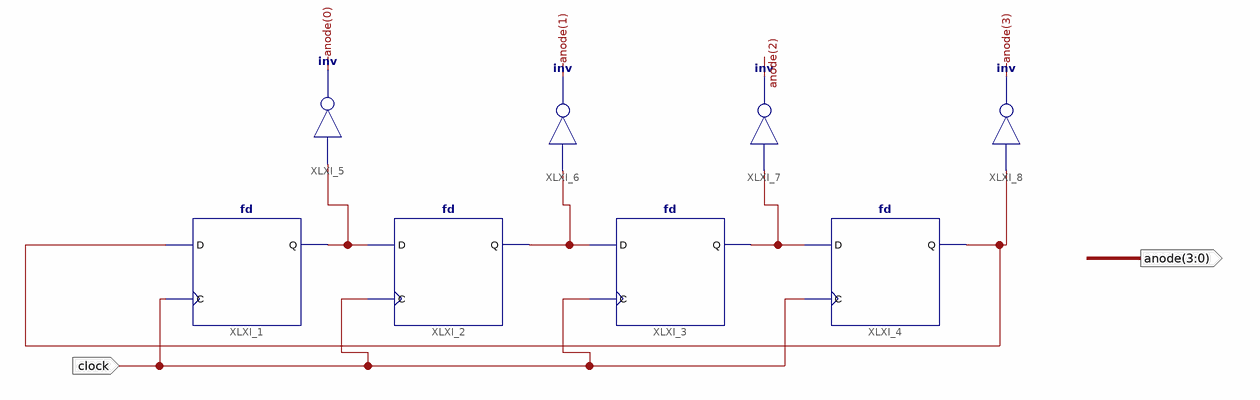
[diagram p0: schematic sheet 1]
// Xilinx ISE schematic ringcounter.sch (artix7) as structural Verilog: 8 symbols, 2 ports
module ringcounter (
  input  clock,
  output [3:0] anode
);

  wire XLXN_9, XLXN_10, XLXN_11, XLXN_12;

  fd #(.INIT("1")) XLXI_1 (.C(clock), .D(XLXN_9), .Q(XLXN_10));
  fd XLXI_2 (.C(clock), .D(XLXN_10), .Q(XLXN_11));
  fd XLXI_3 (.C(clock), .D(XLXN_11), .Q(XLXN_12));
  fd XLXI_4 (.C(clock), .D(XLXN_12), .Q(XLXN_9));
  not XLXI_5 (anode[0], XLXN_10);
  not XLXI_6 (anode[1], XLXN_11);
  not XLXI_7 (anode[2], XLXN_12);
  not XLXI_8 (anode[3], XLXN_9);
endmodule
